# EAGLE design JTAG_Adapter V1 (EAGLE 5.11)
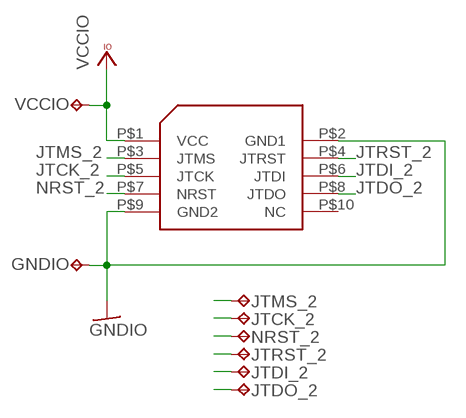
[diagram p0: schematic, sheet 1]

## Parts
GNDIO  TP  [STANDARD]
JTCK_2  TP  [STANDARD]
JTDI_2  TP  [STANDARD]
JTDO_2  TP  [STANDARD]
JTMS_2  TP  [STANDARD]
JTRST_2  TP  [STANDARD]
NRST_2  TP  [STANDARD]
U$1  STM32-JTAG-10P  [STM32-JTAG-10P]
VCCIO  TP  [STANDARD]

## Nets
GNDIO: GNDIO.P$1(TP) U$1.P$2(GND1) U$1.P$9(GND2)
JTCK_2: JTCK_2.P$1(TP) U$1.P$5(JTCK)
JTDI_2: JTDI_2.P$1(TP) U$1.P$6(JTDI)
JTDO_2: JTDO_2.P$1(TP) U$1.P$8(JTDO)
JTMS_2: JTMS_2.P$1(TP) U$1.P$3(JTMS)
JTRST_2: JTRST_2.P$1(TP) U$1.P$4(JTRST)
NRST_2: NRST_2.P$1(TP) U$1.P$7(NRST)
VCCIO: U$1.P$1(VCC) VCCIO.P$1(TP)
Unconnected: U$1.P$10(NC)

## Library data of the parts
GNDIO JTCK_2 JTDI_2 JTDO_2 JTMS_2 JTRST_2 NRST_2 VCCIO = testpad:TP: Test pad
U$1 = dublib:STM32-JTAG-10P

## Board
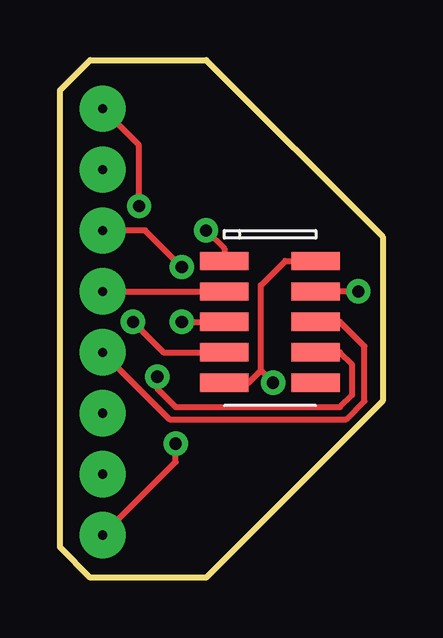
[diagram p1: board, top side]
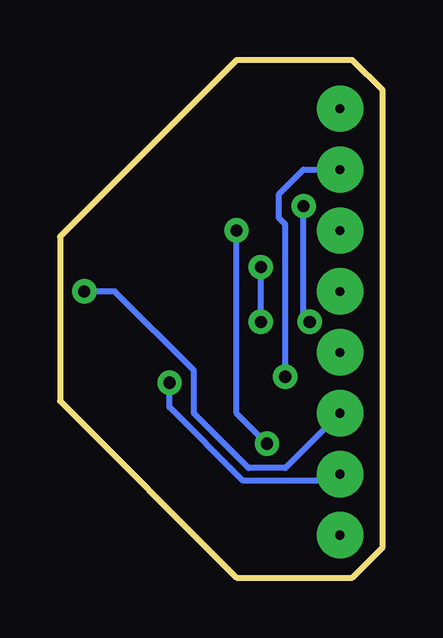
[diagram p2: board, bottom side, seen from below]

Size 13.46 x 21.59 mm. Coordinates in mm from the lower left corner, seen from the top.
Outline: 0,20.32 1.27,21.59 6.1,21.59 13.46,14.22 13.46,7.37 6.1,0 1.27,0 0,1.27 0,20.32
Copper layers (1*16): Top 0.035mm / dielectric 1.5mm / Bottom 0.035mm
Design rules "BatchPcb (Production)": minimum track width 8mil, minimum drill 20mil, track to track 8mil, track to pad 8mil, pad to pad 4mil, via to via 8mil, smd to smd 4mil, copper to edge 10mil, drill to drill 8mil, minimum pad ring 12mil, minimum via ring 10mil, stop-mask expansion 4mil, vias tented up to drill 25mil, thermal gap 10mil

### Footprints (pad centres in the part's own frame; a part is rotated, then mirrored left to right if it is on the bottom)
STANDARD = drill 0.381 pad 1.93 round: P$1 0,0
STM32-JTAG-10P = smd 0.762 x 2.032: P$1 0,0; P$2 0,3.81; P$3 1.27,0; P$4 1.27,3.81; P$5 2.54,0; P$6 2.54,3.81; P$7 3.81,0; P$8 3.81,3.81; P$9 5.08,0; P$10 5.08,3.81

### Placement (x,y rotation side)
GNDIO  1.78,4.32 0 top
JTCK_2  1.78,14.48 0 top
JTDI_2  1.78,9.4 0 top
JTDO_2  1.78,17.02 0 top
JTMS_2  1.78,11.94 0 top
JTRST_2  1.78,6.86 0 top
NRST_2  1.78,19.56 0 top
U$1  6.86,13.21 270 top
VCCIO  1.78,1.78 0 top

### Tracks (layer width: path | path; a pad name or v marks a point on that pad's centre or on a via)
GNDIO  (via drill 0.51)
  Top 0.254: U$1.P$9 7.87,8.13 8.38,8.64 | 8.38,8.64 8.38,12.19 9.4,13.21 U$1.P$2 | v8.89,8.13 8.38,8.64
  Bottom 0.254: v8.89,8.13 8.89,7.11 5.84,4.06 2.03,4.06 GNDIO.P$1
JTCK_2  (via drill 0.51)
  Top 0.254: v5.08,10.67 U$1.P$5 | v5.08,12.95 3.56,14.48 JTCK_2.P$1
  Bottom 0.254: v5.08,10.67 v5.08,12.95
JTDI_2
  Top 0.254: JTDI_2.P$1 4.57,6.6 11.94,6.6 12.7,7.37 12.7,9.65 11.68,10.67 U$1.P$6
JTDO_2  (via drill 0.51)
  Top 0.254: U$1.P$8 11.68,9.4 12.19,8.89 12.19,7.62 11.68,7.11 4.83,7.11 4.06,7.87 v4.06,8.38
  Bottom 0.254: JTDO_2.P$1 3.3,17.02 4.32,16 4.32,14.99 4.06,14.73 v4.06,8.38
JTMS_2
  Top 0.254: JTMS_2.P$1 U$1.P$3
JTRST_2  (via drill 0.51)
  Top 0.254: v12.45,11.94 U$1.P$4
  Bottom 0.254: 11.94,11.94 v12.45,11.94 11.18,11.94 7.87,8.64 7.87,6.86 5.59,4.57 4.06,4.57 JTRST_2.P$1
NRST_2  (via drill 0.51)
  Top 0.254: U$1.P$7 4.32,9.4 v3.05,10.67 | v3.3,15.49 3.3,18.03 NRST_2.P$1
  Bottom 0.254: v3.05,10.67 3.3,10.92 v3.3,15.49
VCCIO  (via drill 0.51)
  Top 0.254: U$1.P$1 6.86,13.72 v6.1,14.48 | v4.83,5.59 4.83,4.83 VCCIO.P$1
  Bottom 0.254: v6.1,14.48 6.1,6.86 v4.83,5.59